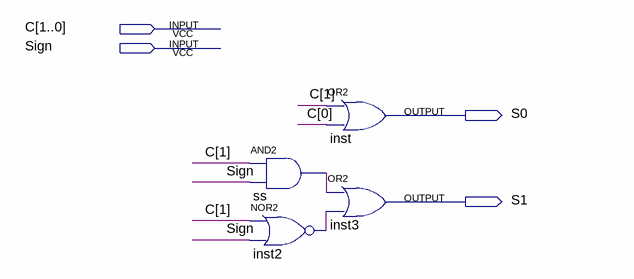
[diagram p0: schematic sheet]
// Quartus schematic Control_AU1.bdf as structural Verilog: 4 symbols, 4 pins
module Control_AU1 (
  input  [1:0] C,
  input  Sign,
  output S0,
  output S1
);

  wire inst2_out, ss_out;

  and ss (ss_out, C[1], Sign);
  nor inst2 (inst2_out, C[1], Sign);
  or inst (S0, C[1], C[0]);
  or inst3 (S1, ss_out, inst2_out);
endmodule
